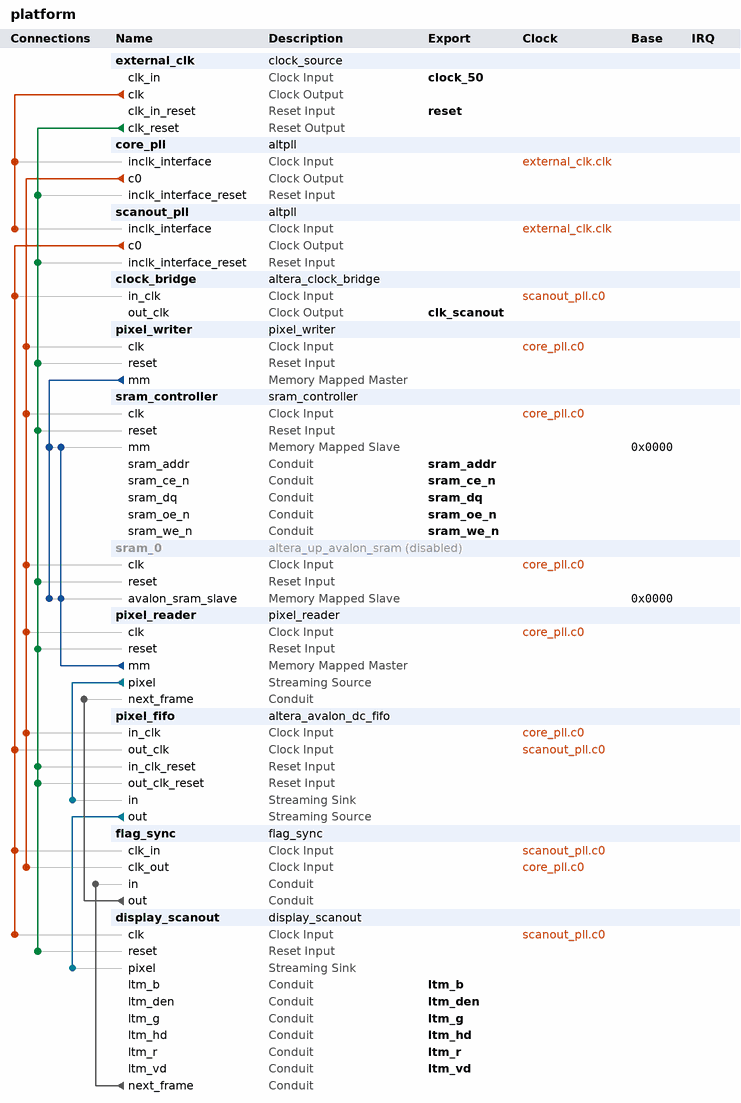
[diagram p0: system contents]
# Platform Designer (Qsys) system platform, Cyclone IV E EP4CE115F29C7
# Parameters at their usual value, and those the tool derives, are not listed.
package require -exact qsys 21.1
create_system platform
set_project_property DEVICE_FAMILY {Cyclone IV E}
set_project_property DEVICE EP4CE115F29C7

add_instance external_clk clock_source 21.1
set_instance_parameter_value external_clk clockFrequency 50000000

add_instance core_pll altpll 21.1
set_instance_parameter_value core_pll CLK0_DIVIDE_BY 2
set_instance_parameter_value core_pll CLK0_MULTIPLY_BY 5
set_instance_parameter_value core_pll INCLK0_INPUT_FREQUENCY 20000
set_instance_parameter_value core_pll PORT_ARESET PORT_UNUSED
set_instance_parameter_value core_pll PORT_LOCKED PORT_UNUSED
set_instance_parameter_value core_pll PORT_clk1 PORT_UNUSED
set_instance_parameter_value core_pll PORT_clk2 PORT_UNUSED
set_instance_parameter_value core_pll PORT_clk3 PORT_UNUSED

add_instance scanout_pll altpll 21.1
set_instance_parameter_value scanout_pll CLK0_DIVIDE_BY 3125
set_instance_parameter_value scanout_pll CLK0_MULTIPLY_BY 2079
set_instance_parameter_value scanout_pll INCLK0_INPUT_FREQUENCY 20000
set_instance_parameter_value scanout_pll PORT_ARESET PORT_UNUSED
set_instance_parameter_value scanout_pll PORT_LOCKED PORT_UNUSED
set_instance_parameter_value scanout_pll PORT_clk1 PORT_UNUSED
set_instance_parameter_value scanout_pll PORT_clk2 PORT_UNUSED
set_instance_parameter_value scanout_pll PORT_clk3 PORT_UNUSED

add_instance clock_bridge altera_clock_bridge 21.1
set_instance_parameter_value clock_bridge DERIVED_CLOCK_RATE 33264000
set_instance_parameter_value clock_bridge EXPLICIT_CLOCK_RATE 0

add_instance pixel_writer pixel_writer 21.1

add_instance sram_controller sram_controller 21.1

add_instance sram_0 altera_up_avalon_sram 18.0
set_instance_property sram_0 ENABLED false
set_instance_parameter_value sram_0 board DE2-115
set_instance_parameter_value sram_0 pixel_buffer false

add_instance pixel_reader pixel_reader 21.1

add_instance pixel_fifo altera_avalon_dc_fifo 21.1
set_instance_parameter_value pixel_fifo BITS_PER_SYMBOL 24
set_instance_parameter_value pixel_fifo FIFO_DEPTH 256
set_instance_parameter_value pixel_fifo USE_PACKETS 0

add_instance flag_sync flag_sync 21.1

add_instance display_scanout display_scanout 21.1

# connections
add_connection core_pll.c0 flag_sync.clk_out clock
add_connection core_pll.c0 pixel_fifo.in_clk clock
add_connection core_pll.c0 pixel_reader.clk clock
add_connection core_pll.c0 pixel_writer.clk clock
add_connection core_pll.c0 sram_0.clk clock
add_connection core_pll.c0 sram_controller.clk clock
add_connection external_clk.clk core_pll.inclk_interface clock
add_connection external_clk.clk scanout_pll.inclk_interface clock
add_connection scanout_pll.c0 clock_bridge.in_clk clock
add_connection scanout_pll.c0 display_scanout.clk clock
add_connection scanout_pll.c0 flag_sync.clk_in clock
add_connection scanout_pll.c0 pixel_fifo.out_clk clock
add_connection external_clk.clk_reset core_pll.inclk_interface_reset reset
add_connection external_clk.clk_reset display_scanout.reset reset
add_connection external_clk.clk_reset pixel_fifo.in_clk_reset reset
add_connection external_clk.clk_reset pixel_fifo.out_clk_reset reset
add_connection external_clk.clk_reset pixel_reader.reset reset
add_connection external_clk.clk_reset pixel_writer.reset reset
add_connection external_clk.clk_reset scanout_pll.inclk_interface_reset reset
add_connection external_clk.clk_reset sram_0.reset reset
add_connection external_clk.clk_reset sram_controller.reset reset
add_connection pixel_reader.mm sram_0.avalon_sram_slave avalon
set_connection_parameter_value pixel_reader.mm/sram_0.avalon_sram_slave arbitrationPriority 10
set_connection_parameter_value pixel_reader.mm/sram_0.avalon_sram_slave baseAddress 0x0000
add_connection pixel_reader.mm sram_controller.mm avalon
set_connection_parameter_value pixel_reader.mm/sram_controller.mm arbitrationPriority 10
set_connection_parameter_value pixel_reader.mm/sram_controller.mm baseAddress 0x0000
add_connection pixel_writer.mm sram_0.avalon_sram_slave avalon
set_connection_parameter_value pixel_writer.mm/sram_0.avalon_sram_slave baseAddress 0x0000
add_connection pixel_writer.mm sram_controller.mm avalon
set_connection_parameter_value pixel_writer.mm/sram_controller.mm baseAddress 0x0000
add_connection pixel_fifo.out display_scanout.pixel avalon_streaming
add_connection pixel_reader.pixel pixel_fifo.in avalon_streaming
add_connection display_scanout.next_frame flag_sync.in conduit
add_connection flag_sync.out pixel_reader.next_frame conduit

# exported interfaces
add_interface clk_scanout clock source
set_interface_property clk_scanout EXPORT_OF clock_bridge.out_clk
add_interface clock_50 clock sink
set_interface_property clock_50 EXPORT_OF external_clk.clk_in
add_interface ltm_b conduit end
set_interface_property ltm_b EXPORT_OF display_scanout.ltm_b
add_interface ltm_den conduit end
set_interface_property ltm_den EXPORT_OF display_scanout.ltm_den
add_interface ltm_g conduit end
set_interface_property ltm_g EXPORT_OF display_scanout.ltm_g
add_interface ltm_hd conduit end
set_interface_property ltm_hd EXPORT_OF display_scanout.ltm_hd
add_interface ltm_r conduit end
set_interface_property ltm_r EXPORT_OF display_scanout.ltm_r
add_interface ltm_vd conduit end
set_interface_property ltm_vd EXPORT_OF display_scanout.ltm_vd
add_interface reset reset sink
set_interface_property reset EXPORT_OF external_clk.clk_in_reset
add_interface sram_addr conduit end
set_interface_property sram_addr EXPORT_OF sram_controller.sram_addr
add_interface sram_ce_n conduit end
set_interface_property sram_ce_n EXPORT_OF sram_controller.sram_ce_n
add_interface sram_dq conduit end
set_interface_property sram_dq EXPORT_OF sram_controller.sram_dq
add_interface sram_oe_n conduit end
set_interface_property sram_oe_n EXPORT_OF sram_controller.sram_oe_n
add_interface sram_we_n conduit end
set_interface_property sram_we_n EXPORT_OF sram_controller.sram_we_n

set_interconnect_requirement {$system} qsys_mm.clockCrossingAdapter HANDSHAKE
set_interconnect_requirement {$system} qsys_mm.enableEccProtection FALSE
set_interconnect_requirement {$system} qsys_mm.insertDefaultSlave FALSE
set_interconnect_requirement {$system} qsys_mm.maxAdditionalLatency 1
set_interconnect_requirement sram_0.avalon_sram_slave qsys_mm.arbitrationScheme fixed-priority

save_system platform.qsys
